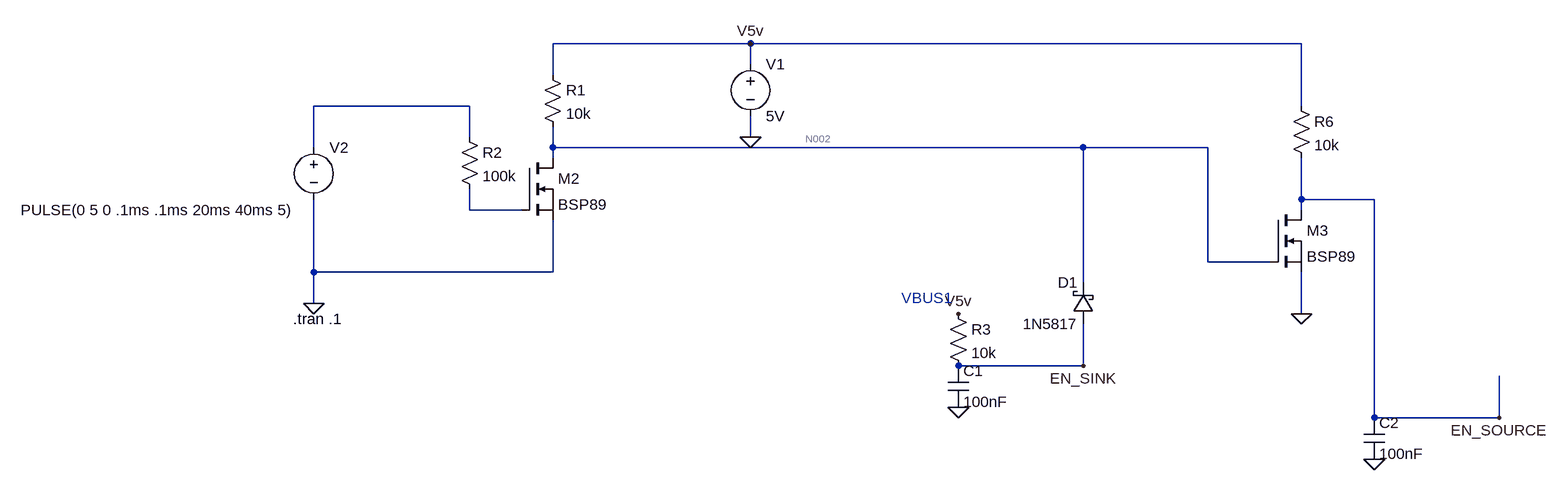
[diagram p0: schematic break_before_make_usbloadswitch.asc]
break_before_make_usbloadswitch.asc, the LTspice schematic file:
Version 4.1
SHEET 1 1316 680
WIRE -576 -32 -880 -32
WIRE 272 -32 -576 -32
WIRE -576 0 -576 -32
WIRE -880 16 -880 -32
WIRE -1008 64 -1248 64
WIRE 272 64 272 -32
WIRE -1008 112 -1008 64
WIRE -576 112 -576 80
WIRE -1248 128 -1248 64
WIRE -880 128 -880 96
WIRE -64 128 -880 128
WIRE 128 128 -64 128
WIRE -880 144 -880 128
WIRE 272 208 272 144
WIRE 384 208 272 208
WIRE -1008 224 -1008 192
WIRE -928 224 -1008 224
WIRE 272 224 272 208
WIRE 128 304 128 128
WIRE 224 304 128 304
WIRE -1248 320 -1248 208
WIRE -880 320 -880 240
WIRE -880 320 -1248 320
WIRE -64 336 -64 128
WIRE -1248 368 -1248 320
WIRE 272 384 272 320
WIRE -64 464 -64 400
WIRE -64 464 -256 464
WIRE 384 544 384 208
WIRE 576 544 576 480
WIRE 576 544 384 544
FLAG -1248 368 0
FLAG -576 112 0
FLAG -576 -32 V5v
FLAG -256 384 V5v
FLAG -256 528 0
FLAG -64 464 EN_SINK
FLAG 272 384 0
FLAG 384 608 0
FLAG 576 544 EN_SOURCE
SYMBOL voltage -1248 112 R0
WINDOW 3 -451 112 Left 2
WINDOW 123 0 0 Left 0
WINDOW 39 0 0 Left 0
SYMATTR InstName V2
SYMATTR Value PULSE(0 5 0 .1ms .1ms 20ms 40ms 5)
SYMBOL nmos -928 144 R0
SYMATTR InstName M2
SYMATTR Value BSP89
SYMBOL voltage -576 -16 R0
WINDOW 123 0 0 Left 0
WINDOW 39 0 0 Left 0
SYMATTR InstName V1
SYMATTR Value 5V
SYMBOL res -896 0 R0
SYMATTR InstName R1
SYMATTR Value 10k
SYMBOL res -1024 96 R0
SYMATTR InstName R2
SYMATTR Value 100k
SYMBOL res -272 368 R0
SYMATTR InstName R3
SYMATTR Value 10k
SYMBOL schottky -48 400 R180
WINDOW 0 24 64 Left 2
WINDOW 3 24 0 Left 2
SYMATTR InstName D1
SYMATTR Value 1N5817
SYMATTR Description Diode
SYMATTR Type diode
SYMBOL cap -272 464 R0
SYMATTR InstName C1
SYMATTR Value 100nF
SYMBOL nmos 224 224 R0
SYMATTR InstName M3
SYMATTR Value BSP89
SYMBOL res 256 48 R0
SYMATTR InstName R6
SYMATTR Value 10k
SYMBOL cap 368 544 R0
SYMATTR InstName C2
SYMATTR Value 100nF
TEXT -1280 392 Left 2 !.tran .1
TEXT -344 360 Left 2 ;VBUS1

The netlist it stands for:
* break_before_make_usbloadswitch.asc
V2 N001 0 PULSE(0 5 0 .1ms .1ms 20ms 40ms 5)
M2 N002 N003 0 0 BSP89
V1 V5v 0 5V
R1 V5v N002 10k
R2 N001 N003 100k
R3 V5v EN_SINK 10k
D1 EN_SINK N002 1N5817
C1 EN_SINK 0 100nF
M3 EN_SOURCE N002 0 0 BSP89
R6 V5v EN_SOURCE 10k
C2 EN_SOURCE 0 100nF
.model D D
.lib standard.dio
.model NMOS NMOS
.model PMOS PMOS
.lib standard.mos
.tran .1
* VBUS1
.backanno
.end

* Results of the author's LTspice run, read from the files saved beside the schematic
* Operating Point, zero values left out:
*   V(en_sink) = 5 V
*   V(en_source) = 2.066 mV
*   V(n002) = 5 V
*   V(v5v) = 5 V
*   I(D1) = 5.016 pA
*   I(R1) = 5.579 pA
*   I(R3) = 5.017 pA
*   I(R6) = 499.8 µA
*   I(V1) = -499.8 µA
*   Id(M2) = 5.598 pA
*   Id(M3) = 499.8 µA
*   Is(M2) = -5.598 pA
*   Is(M3) = -499.8 µA
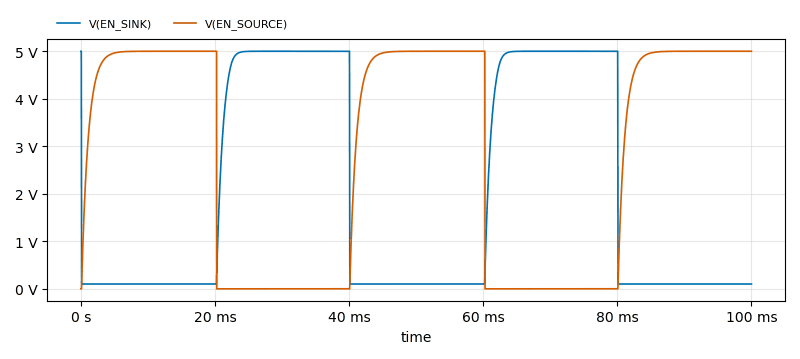
[diagram p1: Transient Analysis of break_before_make_usbloadswitch.asc, plotted from the saved traces]
* Transient Analysis, 1 run:
*   V(EN_SINK): min 103.6 mV, max 5 V, average 1.97 V, rms 3.057 V, last 103.6 mV
*   V(EN_SOURCE): min 2.01 mV, max 5 V, average 2.864 V, rms 3.734 V, last 5 V